# Altium schematic sheet ARC.SchDoc
size A
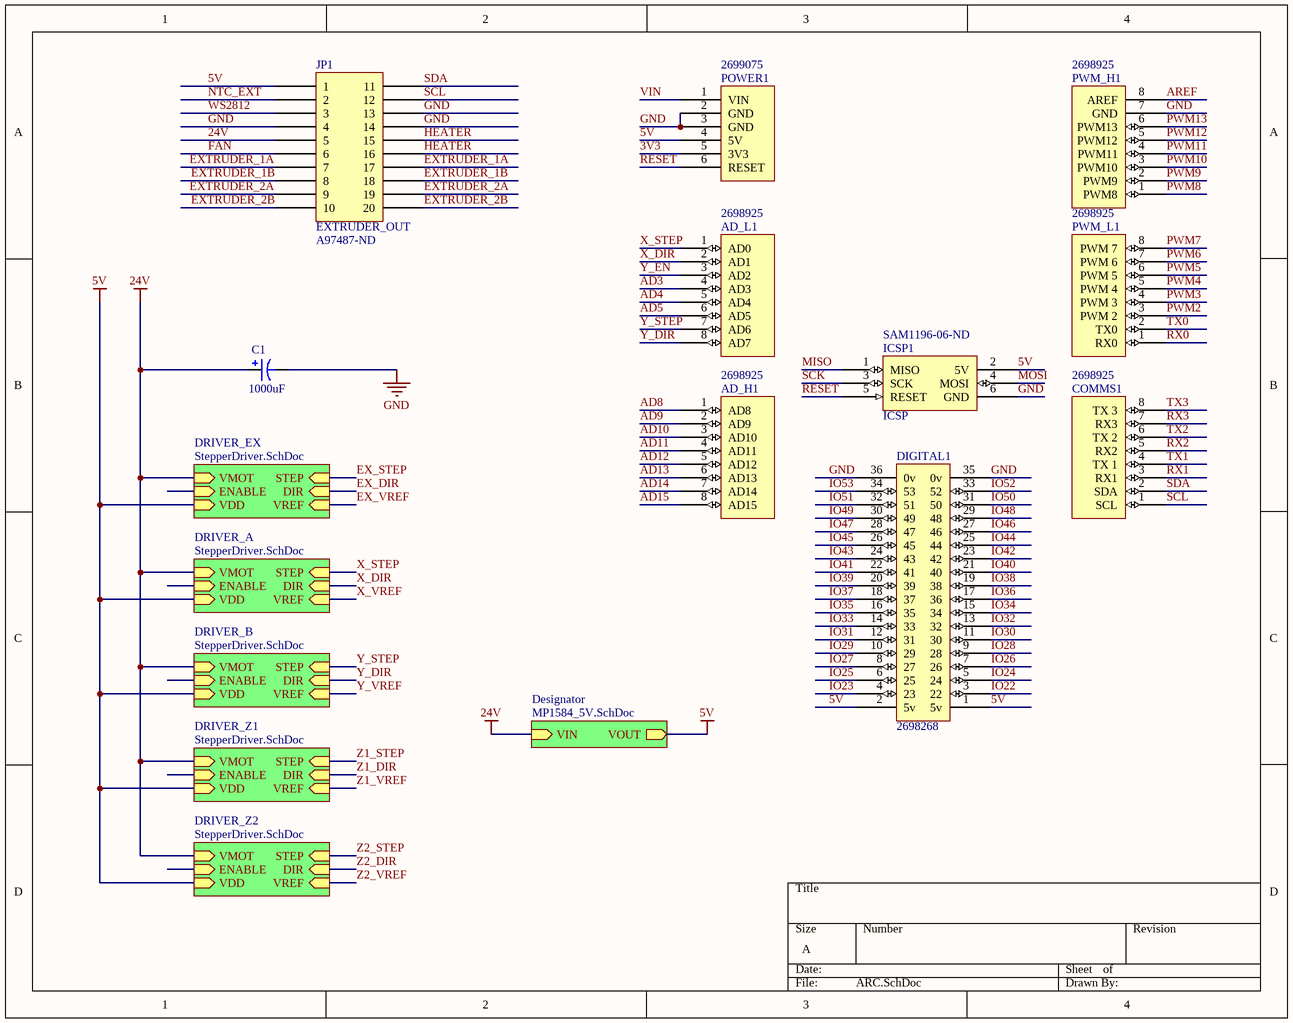
[diagram p0: ARC.SchDoc]

## Parts
AD_H1  Supplier Part Number 4: 2698925  [Header 8x1 8.5mm]  (hidden comment: AD_H)
AD_L1  Supplier Part Number 5: 2698925  [Header 8x1 8.5mm]  (hidden comment: AD_L)
C1  1000uF  [CAP_12.5mm]
COMMS1  Supplier Part Number 4: 2698925  [Header 8x1 8.5mm]  (hidden comment: Communication)
DIGITAL1  Supplier Part Number 5: 2698268  [HEADER 36X 8MM]  (hidden comment: IO_36)
ICSP1  ICSP  Supplier Part Number 5: SAM1196-06-ND  [ICSP]
JP1  EXTRUDER_OUT  Supplier Part Number 1: A97487-ND  [IDC20]
POWER1  Supplier Part Number 2: 2699075  [Header 6x1 8.5mm]  (hidden comment: POWER)
PWM_H1  Supplier Part Number 4: 2698925  [Header 8x1 8.5mm]  (hidden comment: PWM_H)
PWM_L1  Supplier Part Number 4: 2698925  [Header 8x1 8.5mm]  (hidden comment: PWM_L)

## Sub-sheets
Designator = MP1584_5V.SchDoc: VIN (in), VOUT (out)
DRIVER_A = StepperDriver.SchDoc: VMOT (in), VDD (in), STEP (in), DIR (in), VREF (in), ENABLE (in)
DRIVER_B = StepperDriver.SchDoc: VMOT (in), VDD (in), STEP (in), DIR (in), VREF (in), ENABLE (in)
DRIVER_EX = StepperDriver.SchDoc: VMOT (in), VDD (in), STEP (in), DIR (in), VREF (in), ENABLE (in)
DRIVER_Z1 = StepperDriver.SchDoc: VMOT (in), VDD (in), STEP (in), DIR (in), VREF (in), ENABLE (in)
DRIVER_Z2 = StepperDriver.SchDoc: VMOT (in), VDD (in), STEP (in), DIR (in), VREF (in), ENABLE (in)

## Nets
5V: DIGITAL1.1(5v) DIGITAL1.2(5v) ICSP1.2(5V) JP1.1 POWER1.4(5V) ; sheet DRIVER_EX/VDD, sheet DRIVER_A/VDD, sheet DRIVER_Z1/VDD, sheet DRIVER_B/VDD, sheet DRIVER_Z2/VDD, sheet Designator/VOUT
24V: C1.0 JP1.5 ; sheet DRIVER_EX/VMOT, sheet DRIVER_A/VMOT, sheet DRIVER_Z1/VMOT, sheet DRIVER_B/VMOT, sheet DRIVER_Z2/VMOT, sheet Designator/VIN
GND: C1.1 DIGITAL1.35(0v) DIGITAL1.36(0v) ICSP1.6(GND) JP1.4 JP1.13 JP1.14 POWER1.2(GND) POWER1.3(GND) PWM_H1.7(GND)
3V3: POWER1.5(3V3)
AD3: AD_L1.4(AD3)
AD4: AD_L1.5(AD4)
AD5: AD_L1.6(AD5)
AD8: AD_H1.1(AD8)
AD9: AD_H1.2(AD9)
AD10: AD_H1.3(AD10)
AD11: AD_H1.4(AD11)
AD12: AD_H1.5(AD12)
AD13: AD_H1.6(AD13)
AD14: AD_H1.7(AD14)
AD15: AD_H1.8(AD15)
AREF: PWM_H1.8(AREF)
EX_DIR: sheet DRIVER_EX/DIR
EX_STEP: sheet DRIVER_EX/STEP
EX_VREF: sheet DRIVER_EX/VREF
EXTRUDER_1A: JP1.7 JP1.17
EXTRUDER_1B: JP1.8 JP1.18
EXTRUDER_2A: JP1.9 JP1.19
EXTRUDER_2B: JP1.10 JP1.20
FAN: JP1.6
HEATER: JP1.15 JP1.16
IO22: DIGITAL1.3(22)
IO23: DIGITAL1.4(23)
IO24: DIGITAL1.5(24)
IO25: DIGITAL1.6(25)
IO26: DIGITAL1.7(26)
IO27: DIGITAL1.8(27)
IO28: DIGITAL1.9(28)
IO29: DIGITAL1.10(29)
IO30: DIGITAL1.11(30)
IO31: DIGITAL1.12(31)
IO32: DIGITAL1.13(32)
IO33: DIGITAL1.14(33)
IO34: DIGITAL1.15(34)
IO35: DIGITAL1.16(35)
IO36: DIGITAL1.17(36)
IO37: DIGITAL1.18(37)
IO38: DIGITAL1.19(38)
IO39: DIGITAL1.20(39)
IO40: DIGITAL1.21(40)
IO41: DIGITAL1.22(41)
IO42: DIGITAL1.23(42)
IO43: DIGITAL1.24(43)
IO44: DIGITAL1.25(44)
IO45: DIGITAL1.26(45)
IO46: DIGITAL1.27(46)
IO47: DIGITAL1.28(47)
IO48: DIGITAL1.29(48)
IO49: DIGITAL1.30(49)
IO50: DIGITAL1.31(50)
IO51: DIGITAL1.32(51)
IO52: DIGITAL1.33(52)
IO53: DIGITAL1.34(53)
MISO: ICSP1.1(MISO)
MOSI: ICSP1.4(MOSI)
NTC_EXT: JP1.2
PWM2: PWM_L1.3(PWM_2)
PWM3: PWM_L1.4(PWM_3)
PWM4: PWM_L1.5(PWM_4)
PWM5: PWM_L1.6(PWM_5)
PWM6: PWM_L1.7(PWM_6)
PWM7: PWM_L1.8(PWM_7)
PWM8: PWM_H1.1(PWM8)
PWM9: PWM_H1.2(PWM9)
PWM10: PWM_H1.3(PWM10)
PWM11: PWM_H1.4(PWM11)
PWM12: PWM_H1.5(PWM12)
PWM13: PWM_H1.6(PWM13)
RESET: ICSP1.5(RESET) POWER1.6(RESET)
RX0: PWM_L1.1(RX0)
RX1: COMMS1.3(RX1)
RX2: COMMS1.5(RX2)
RX3: COMMS1.7(RX3)
SCK: ICSP1.3(SCK)
SCL: COMMS1.1(SCL) JP1.12
SDA: COMMS1.2(SDA) JP1.11
TX0: PWM_L1.2(TX0)
TX1: COMMS1.4(TX_1)
TX2: COMMS1.6(TX_2)
TX3: COMMS1.8(TX_3)
VIN: POWER1.1(VIN)
WS2812: JP1.3
X_DIR: AD_L1.2(AD1) ; sheet DRIVER_A/DIR
X_STEP: AD_L1.1(AD0) ; sheet DRIVER_A/STEP
X_VREF: sheet DRIVER_A/VREF
Y_DIR: AD_L1.8(AD7) ; sheet DRIVER_B/DIR
Y_EN: AD_L1.3(AD2)
Y_STEP: AD_L1.7(AD6) ; sheet DRIVER_B/STEP
Y_VREF: sheet DRIVER_B/VREF
Z1_DIR: sheet DRIVER_Z1/DIR
Z1_STEP: sheet DRIVER_Z1/STEP
Z1_VREF: sheet DRIVER_Z1/VREF
Z2_DIR: sheet DRIVER_Z2/DIR
Z2_STEP: sheet DRIVER_Z2/STEP
Z2_VREF: sheet DRIVER_Z2/VREF

## Library data of the parts
C1 = CAP_12.5MM_GENERIC: Generic electrolytic capacitor w/ 12.5mm diameter and 5mm pitch
JP1 = IDC20: Supplier 1: Digi-Key
AD_H1 = AD_H: Supplier 1: Arrow; Supplier Part Number 1: 2698940; Supplier 2: Arrow; Supplier Part Number 2: 2698939; Supplier 3: Digi-Key; Supplier Part Number 3: SAM1198-08-ND; Supplier 4: Arrow
AD_L1 = AD_L: Supplier 1: Digi-Key; Supplier Part Number 1: SAM1198-08-ND; Supplier 2: Arrow; Supplier Part Number 2: 2698939; Supplier 3: Arrow; Supplier Part Number 3: 2698940; Supplier 4: Arrow; Supplier Part Number 4: 43085273; Supplier 5: Arrow
COMMS1 = Communication: Supplier 1: Digi-Key; Supplier Part Number 1: SAM1198-08-ND; Supplier 2: Arrow; Supplier Part Number 2: 2698940; Supplier 3: Arrow; Supplier Part Number 3: 2698939; Supplier 4: Arrow
DIGITAL1 = IO_36: Supplier 1: Digi-Key; Supplier Part Number 1: SAM1196-18-ND; Supplier 2: Arrow; Supplier Part Number 2: 48117090; Supplier 3: Arrow; Supplier Part Number 3: 46093326; Supplier 4: Arrow; Supplier Part Number 4: 2698278; Supplier 5: Arrow
ICSP1 = ICSP: Supplier 1: Digi-Key; Supplier Part Number 1: SAM1185-06-ND; Supplier 2: Arrow; Supplier Part Number 2: 2699117; Supplier 3: Arrow; Supplier Part Number 3: 43862781; Supplier 4: Arrow; Supplier Part Number 4: 2699091; Supplier 5: Digi-Key
POWER1 = POWER: Supplier 1: Arrow; Supplier Part Number 1: 52553843; Supplier 2: Arrow; Supplier 3: Digi-Key; Supplier Part Number 3: SAM1198-06-ND; Supplier 4: Arrow; Supplier Part Number 4: 2699089; Supplier 5: Arrow; Supplier Part Number 5: 2699088
PWM_H1 = PWM_H: Supplier 1: Digi-Key; Supplier Part Number 1: SAM1198-08-ND; Supplier 2: Arrow; Supplier Part Number 2: 2698940; Supplier 3: Arrow; Supplier Part Number 3: 2698939; Supplier 4: Arrow
PWM_L1 = PWM_L: Supplier 1: Arrow; Supplier Part Number 1: 2698940; Supplier 2: Arrow; Supplier Part Number 2: 2698939; Supplier 3: Digi-Key; Supplier Part Number 3: SAM1198-08-ND; Supplier 4: Arrow